# Altium schematic sheet Solid State Relay.SchDoc
size A4
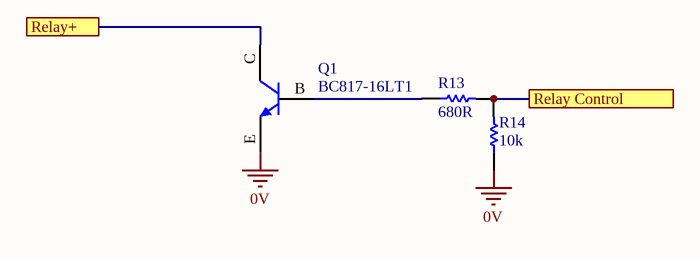
[diagram p0: Solid State Relay.SchDoc]

## Parts
Q1  BC817-16LT1  [ON SOT-23 BJT]
R13  680R  [0805]
R14  10k  [0805]

## Ports
Relay Control, Relay+

## Nets
0V: Q1.E R14.1
Relay Control: R13.2 R14.2 ; port Relay Control
Relay+: Q1.C ; port Relay+
NetQ1_B: Q1.B R13.1

## Library data of the parts
Q1 = BC817-16LT1: 300mW  BJT NPN Transistor; Manufacturer: ON Semiconductor; Part Number: BC817-16LT1; Digikey Part Number: BC817-16LT1OSTR-ND; Digikey Link: https://www.digikey.com.au/product-detail/en/on-semiconductor/BC817-16LT1/BC817-16LT1OSTR-ND/606178
R13 = RC0805FR07680RL: Manufacturer: YAGEO; Tolerance: 0.01; Rated Voltage: 0.125W; Part Number: RC0805FR07680RL; Value: 680R; Material: FR-07; Digikey Part Number: 311-680CRCT-ND
R14 = RC0805FR0710KL: Manufacturer: YAGEO; Tolerance: 0.01; Rated Voltage: 0.125W; Part Number: RC0805FR0710KL; Value: 10k; Digikey Part Number: 311-10.0KCRCT-ND; Material: FR-07